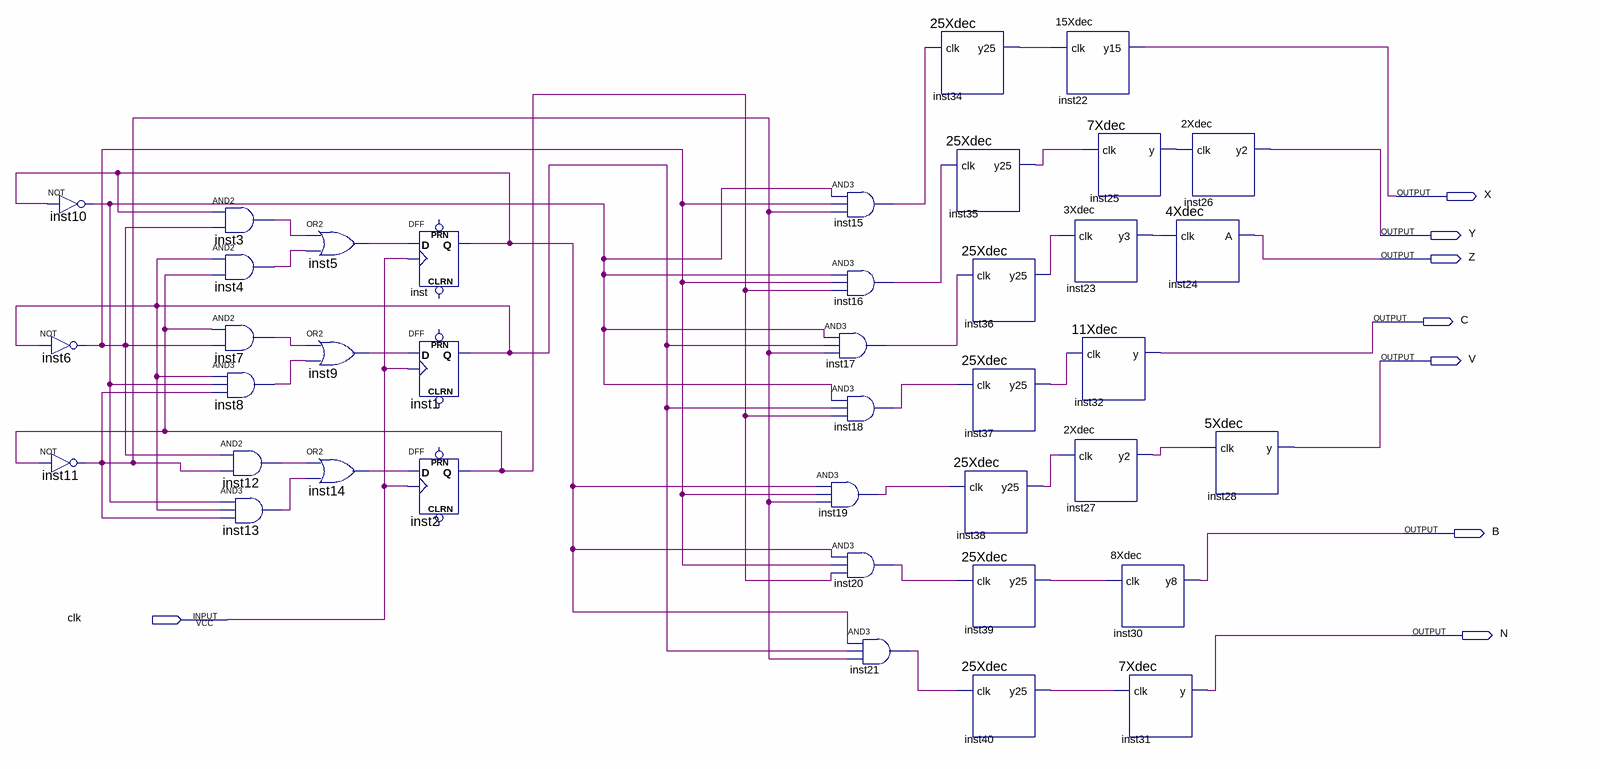
[diagram p0: schematic sheet]
// Quartus schematic ghrtlahfmfvkdlf.bdf as structural Verilog: 39 symbols, 8 pins
module ghrtlahfmfvkdlf (
  input  clk,
  output X,
  output Y,
  output Z,
  output C,
  output V,
  output B,
  output N
);

  wire inst1_q, inst2_q, inst3_out, inst4_out, inst5_out, inst6_out, inst7_out, inst8_out, inst9_out,
       inst10_out, inst11_out, inst12_out, inst13_out, inst14_out, inst15_out, inst16_out, inst17_out,
       inst18_out, inst19_out, inst20_out, inst21_out, inst23_y3, inst25_y, inst27_y2, inst34_y25,
       inst35_y25, inst36_y25, inst37_y25, inst38_y25, inst39_y25, inst40_y25, inst_q;

  not inst10 (inst10_out, inst_q);
  not inst6 (inst6_out, inst1_q);
  not inst11 (inst11_out, inst2_q);
  and inst3 (inst3_out, inst_q, inst6_out);
  and inst4 (inst4_out, inst1_q, inst2_q);
  and inst7 (inst7_out, inst2_q, inst6_out);
  and inst8 (inst8_out, inst1_q, inst10_out, inst11_out);
  and inst12 (inst12_out, inst6_out, inst11_out);
  and inst13 (inst13_out, inst10_out, inst1_q, inst11_out);
  or inst5 (inst5_out, inst3_out, inst4_out);
  or inst9 (inst9_out, inst7_out, inst8_out);
  or inst14 (inst14_out, inst12_out, inst13_out);
  DFF inst (.CLK(clk), .D(inst5_out), .Q(inst_q));  // open: CLRN, PRN
  DFF inst1 (.CLK(clk), .D(inst9_out), .Q(inst1_q));  // open: CLRN, PRN
  DFF inst2 (.CLK(clk), .D(inst14_out), .Q(inst2_q));  // open: CLRN, PRN
  and inst15 (inst15_out, inst10_out, inst6_out, inst11_out);
  and inst16 (inst16_out, inst10_out, inst6_out, inst2_q);
  and inst17 (inst17_out, inst10_out, inst1_q, inst11_out);
  and inst18 (inst18_out, inst10_out, inst1_q, inst2_q);
  and inst19 (inst19_out, inst_q, inst6_out, inst11_out);
  and inst20 (inst20_out, inst_q, inst6_out, inst2_q);
  and inst21 (inst21_out, inst_q, inst1_q, inst11_out);
  \25Xdec  inst34 (.clk(inst15_out), .y25(inst34_y25));
  \25Xdec  inst35 (.clk(inst16_out), .y25(inst35_y25));
  \25Xdec  inst36 (.clk(inst17_out), .y25(inst36_y25));
  \25Xdec  inst37 (.clk(inst18_out), .y25(inst37_y25));
  \25Xdec  inst38 (.clk(inst19_out), .y25(inst38_y25));
  \25Xdec  inst39 (.clk(inst20_out), .y25(inst39_y25));
  \25Xdec  inst40 (.clk(inst21_out), .y25(inst40_y25));
  \15Xdec  inst22 (.clk(inst34_y25), .y15(X));
  \7Xdec  inst25 (.clk(inst35_y25), .y(inst25_y));
  \3Xdec  inst23 (.clk(inst36_y25), .y3(inst23_y3));
  \11Xdec  inst32 (.clk(inst37_y25), .y(C));
  \2Xdec  inst27 (.clk(inst38_y25), .y2(inst27_y2));
  \8Xdec  inst30 (.clk(inst39_y25), .y8(B));
  \7Xdec  inst31 (.clk(inst40_y25), .y(N));
  \2Xdec  inst26 (.clk(inst25_y), .y2(Y));
  \4Xdec  inst24 (.clk(inst23_y3), .A(Z));
  \5Xdec  inst28 (.clk(inst27_y2), .y(V));
endmodule
